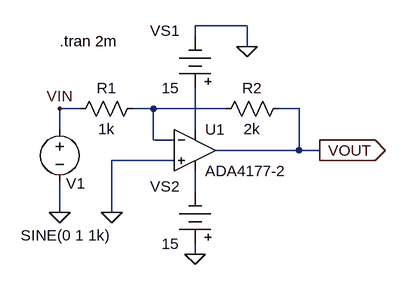
[diagram p0: schematic fig-01-02-04.asc]
fig-01-02-04.asc, the LTspice schematic file:
Version 4
SHEET 1 880 680
WIRE 288 -16 208 -16
WIRE 208 0 208 -16
WIRE 288 16 288 -16
WIRE 32 112 0 112
WIRE 144 112 112 112
WIRE 256 112 144 112
WIRE 368 112 336 112
WIRE 0 144 0 112
WIRE 208 144 208 80
WIRE 144 160 144 112
WIRE 176 160 144 160
WIRE 368 176 368 112
WIRE 368 176 240 176
WIRE 400 176 368 176
WIRE 176 192 80 192
WIRE 208 240 208 208
WIRE 0 272 0 224
WIRE 80 272 80 192
WIRE 208 336 208 320
FLAG 288 16 0
FLAG 208 336 0
FLAG 0 272 0
FLAG 80 272 0
FLAG 400 176 VOUT
IOPIN 400 176 Out
FLAG 0 112 VIN
SYMBOL Misc\\battery 208 96 R180
WINDOW 0 24 104 Left 2
WINDOW 3 24 16 Left 2
SYMATTR InstName VS1
SYMATTR Value 15
SYMBOL Misc\\battery 208 336 R180
WINDOW 0 24 104 Left 2
WINDOW 3 24 16 Left 2
SYMATTR InstName VS2
SYMATTR Value 15
SYMBOL res 128 96 R90
WINDOW 0 0 56 VBottom 2
WINDOW 3 32 56 VTop 2
SYMATTR InstName R1
SYMATTR Value 1k
SYMBOL res 352 96 R90
WINDOW 0 0 56 VBottom 2
WINDOW 3 32 56 VTop 2
SYMATTR InstName R2
SYMATTR Value 2k
SYMBOL voltage 0 128 R0
WINDOW 0 10 99 Left 2
WINDOW 3 -60 179 Left 2
WINDOW 123 0 0 Left 0
WINDOW 39 0 0 Left 0
SYMATTR InstName V1
SYMATTR Value SINE(0 1 1k)
SYMBOL Opamps\\ADA4177-2 208 176 R0
SYMATTR InstName U1
TEXT 0 8 Left 2 !.tran 2m

The netlist it stands for:
* fig-01-02-04.asc
VS1 N002 0 15
VS2 0 N003 15
R1 N001 VIN 1k
R2 VOUT N001 2k
V1 VIN 0 SINE(0 1 1k)
* U1: ADA4177-2 (symbol Opamps\ADA4177-2 not available, pins judged from their places): In+=0 In-=N001 V+=N002 V-=N003 OUT=VOUT
.tran 2m
.backanno
.end